# Altium project GAINS_1521L_BREAKOUT_BOARD.PrjPcb
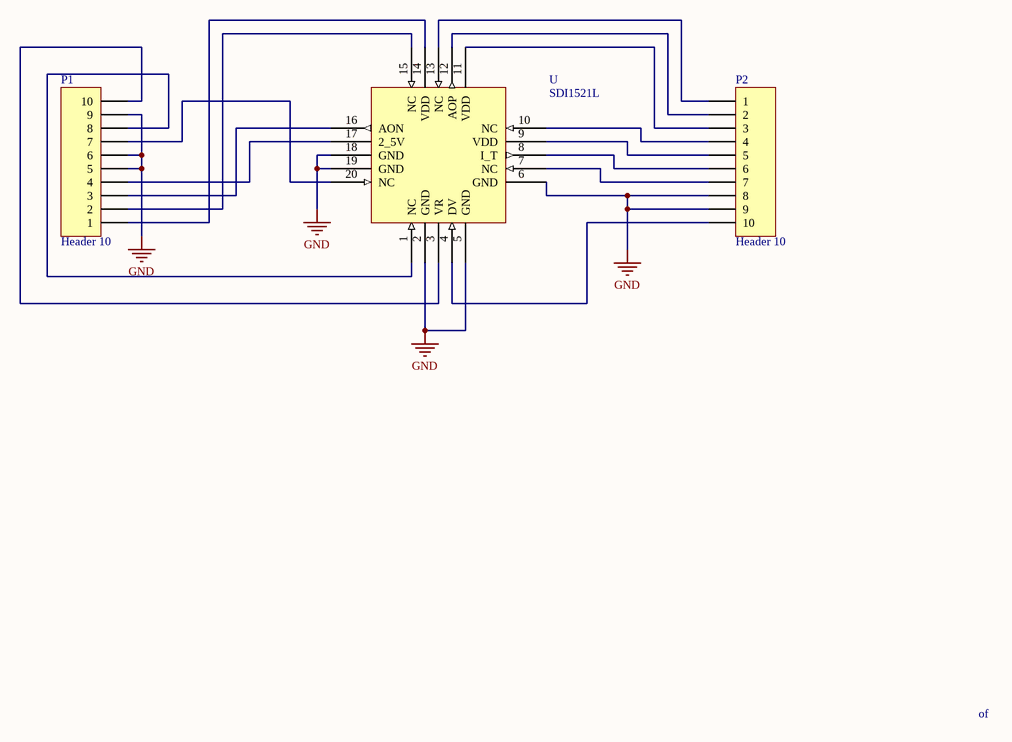
[diagram p0: SDI_1521L_BREAKOUT_BOARD.SchDoc]
1 sheet, 3 parts. Net scope: global (net labels, ports and power ports of the same name join across sheets).
Board file: SDI_1521L_BREAKOUT_BOARD.PcbDoc

## Sheet SDI_1521L_BREAKOUT_BOARD.SchDoc: SDI-1521L Breakout Board
size A; Author: Jason Popich; DocumentNumber: N/A; Revision: 1; SheetNumber: 1; SheetTotal: 1

### Parts
P1  Header 10  [HDR1X10]
P2  Header 10  [HDR1X10]
U  SDI1521L  [SDI 1521L]

### Nets
GND: P1.5 P1.6 P1.9 P2.8 P2.9 U.2(GND) U.5(GND) U.6(GND) U.18(GND) U.19(GND)
NetP1_1: P1.1 U.14(VDD)
NetP1_2: P1.2 U.15(NC)
NetP1_3: P1.3 U.16(AON)
NetP1_4: P1.4 U.17(2_5V)
NetP1_7: P1.7 U.20(NC)
NetP1_8: P1.8 U.1(NC)
NetP1_10: P1.10 U.3(VR)
NetP2_1: P2.1 U.13(NC)
NetP2_2: P2.2 U.12(AOP)
NetP2_3: P2.3 U.11(VDD)
NetP2_4: P2.4 U.10(NC)
NetP2_5: P2.5 U.9(VDD)
NetP2_6: P2.6 U.8(I_T)
NetP2_7: P2.7 U.7(NC)
NetP2_10: P2.10 U.4(DV)

### Notes on the sheet
- of

### Library data of the parts
P1 P2 = Header 10: Header, 10-Pin; LatestRevisionDate: 17-Jul-2002; LatestRevisionNote: Re-released for DXP Platform.; Publisher: Altium Limited
U = SDI1521L: SDI1521L Accelerometer +/- 2G